# EAGLE schematic DrumVoices (EAGLE 6.5.0)
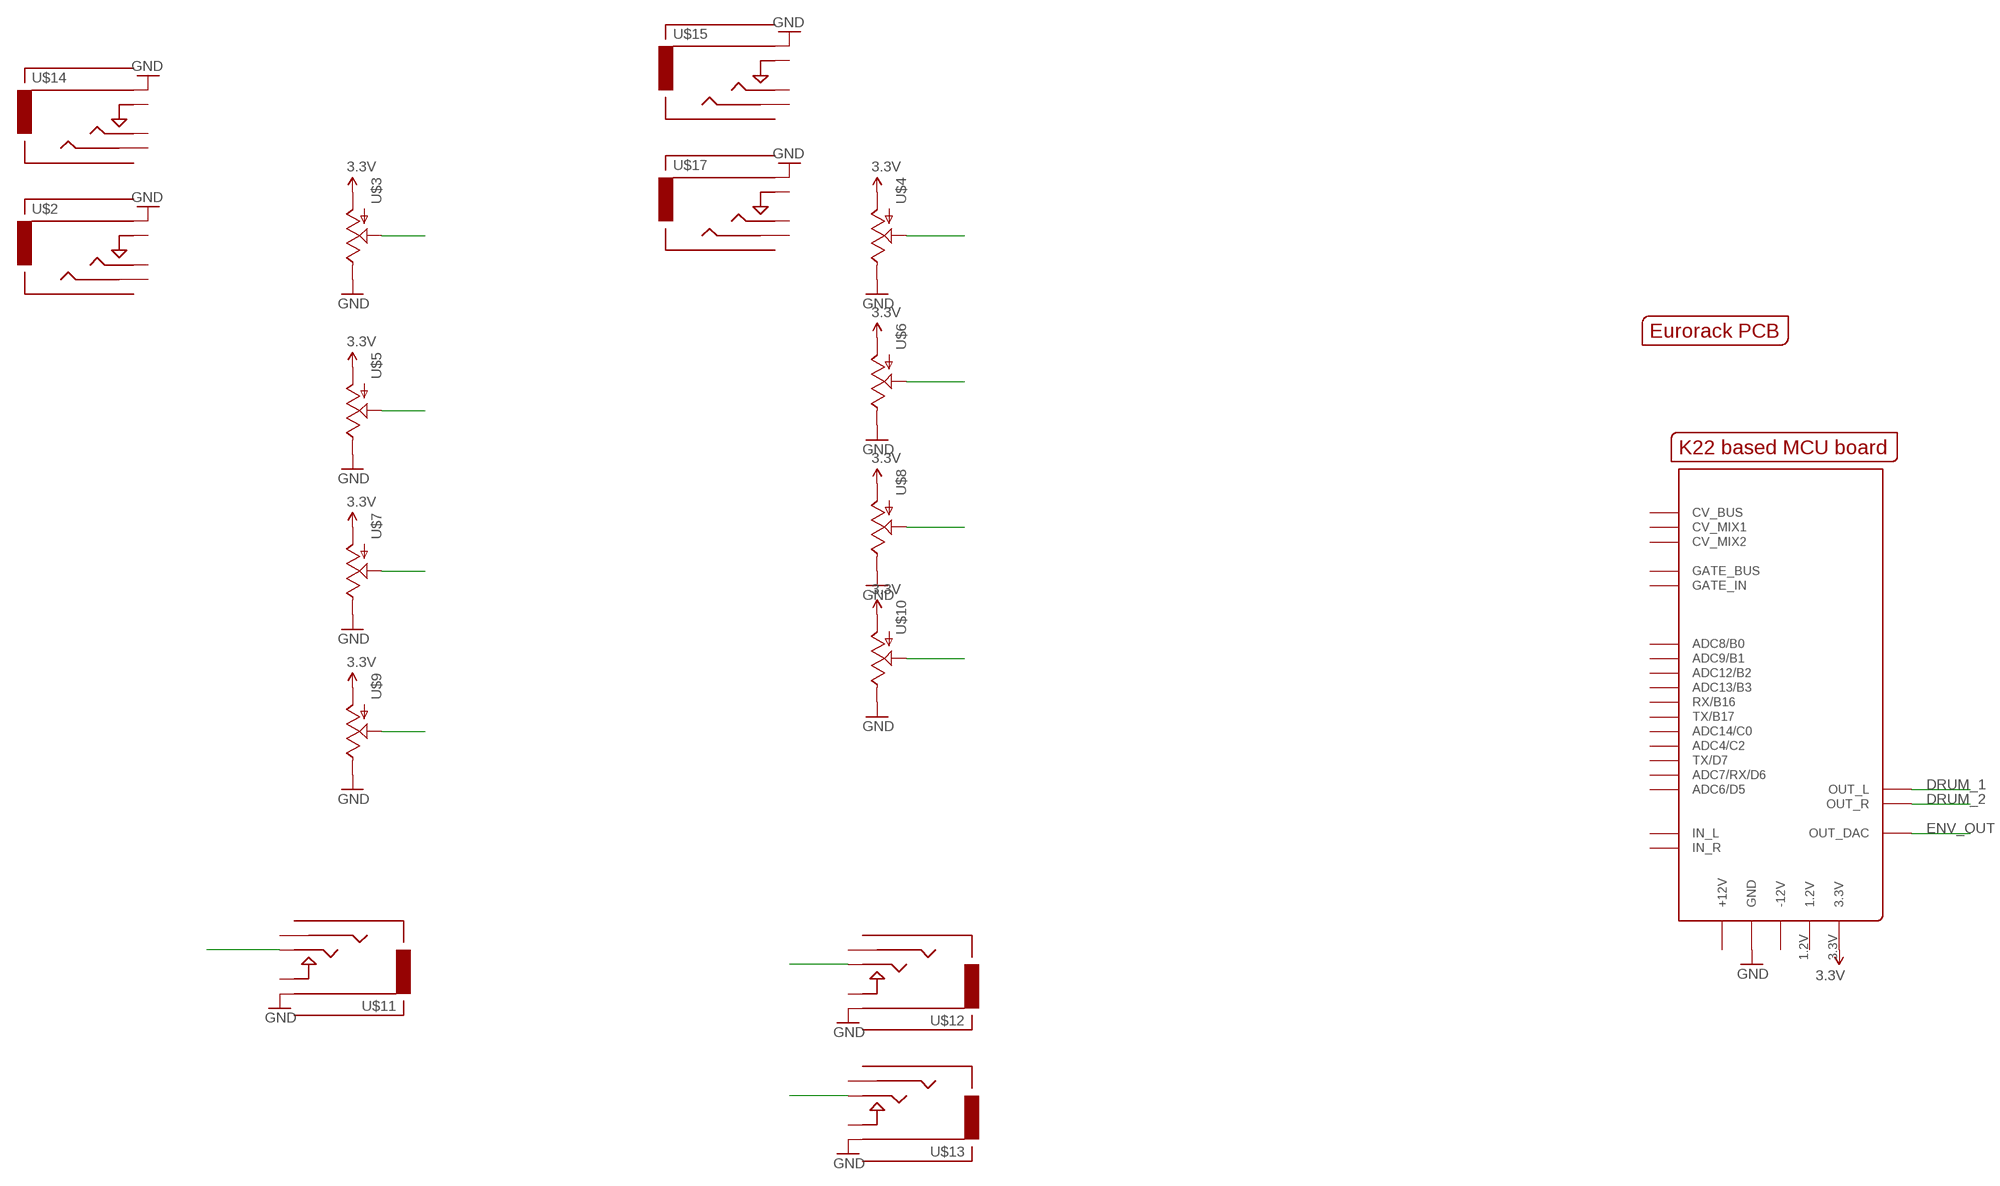
[diagram p0: schematic, sheet 1]

## Parts
U$1  EURORACK_PCB12HP  [EURORACK12HPPCB]
U$2  AUDIO-JACKINPUT  [3.5MM-JACK-SWITCH-13MM-INPUT]
U$3  POTZEPHPOT  [OG-POTS_ALPS_POT_VERTICAL]
U$4  POTZEPHPOT  [OG-POTS_ALPS_POT_VERTICAL]
U$5  POTZEPHPOT  [OG-POTS_ALPS_POT_VERTICAL]
U$6  POTZEPHPOT  [OG-POTS_ALPS_POT_VERTICAL]
U$7  POTZEPHPOT  [OG-POTS_ALPS_POT_VERTICAL]
U$8  POTZEPHPOT  [OG-POTS_ALPS_POT_VERTICAL]
U$9  POTZEPHPOT  [OG-POTS_ALPS_POT_VERTICAL]
U$10  POTZEPHPOT  [OG-POTS_ALPS_POT_VERTICAL]
U$11  AUDIO-JACKOUTPUT  [3.5MM-JACK-SWITCH-13MM-OUTPUT]
U$12  AUDIO-JACKOUTPUT  [3.5MM-JACK-SWITCH-13MM-OUTPUT]
U$13  AUDIO-JACKOUTPUT  [3.5MM-JACK-SWITCH-13MM-OUTPUT]
U$14  AUDIO-JACKINPUT  [3.5MM-JACK-SWITCH-13MM-INPUT]
U$15  AUDIO-JACKINPUT  [3.5MM-JACK-SWITCH-13MM-INPUT]
U$16  MCUBOARD  [MCUBASEBOARD]
U$17  AUDIO-JACKINPUT  [3.5MM-JACK-SWITCH-13MM-INPUT]

## Nets
3.3V: U$3.P$3(A) U$4.P$3(A) U$5.P$3(A) U$6.P$3(A) U$7.P$3(A) U$8.P$3(A) U$9.P$3(A) U$10.P$3(A) U$16.3.3V
DRUM_1: U$11.TIP@1(TIP) U$11.TIP@2(TIP) U$16.OUT_L
DRUM_2: U$12.TIP@1(TIP) U$12.TIP@2(TIP) U$16.OUT_R
ENV_OUT: U$13.TIP@1(TIP) U$13.TIP@2(TIP) U$16.OUT_DAC
GND: U$2.RING@1(RING) U$2.RING@2(RING) U$3.P$1(E) U$4.P$1(E) U$5.P$1(E) U$6.P$1(E) U$7.P$1(E) U$8.P$1(E) U$9.P$1(E) U$10.P$1(E) U$11.RING@1(RING) U$11.RING@2(RING) U$12.RING@1(RING) U$12.RING@2(RING) U$13.RING@1(RING) U$13.RING@2(RING) U$14.RING@1(RING) U$14.RING@2(RING) U$15.RING@1(RING) U$15.RING@2(RING) U$16.GND@1(GND) U$16.GND@2(GND) U$16.GND@4(GND) U$16.GND@5(GND) U$16.GND@6(GND) U$16.GND@7(GND) U$16.GND@8(GND) U$16.GND@9(GND) U$16.GND_BUS(GND) U$17.RING@1(RING) U$17.RING@2(RING)
N$1: U$3.P$2(S)
N$2: U$5.P$2(S)
N$3: U$7.P$2(S)
N$4: U$9.P$2(S)
N$5: U$4.P$2(S)
N$6: U$6.P$2(S)
N$7: U$8.P$2(S)
N$8: U$10.P$2(S)
Unconnected: U$2.SECOND@1(SECOND) U$2.SECOND@2(SECOND) U$2.SWITCH@1(SWITCH) U$2.SWITCH@2(SWITCH) U$2.TIP@1(TIP) U$2.TIP@2(TIP) U$11.SECOND@1(SECOND) U$11.SECOND@2(SECOND) U$11.SWITCH@1(SWITCH) U$11.SWITCH@2(SWITCH) U$12.SECOND@1(SECOND) U$12.SECOND@2(SECOND) U$12.SWITCH@1(SWITCH) U$12.SWITCH@2(SWITCH) U$13.SECOND@1(SECOND) U$13.SECOND@2(SECOND) U$13.SWITCH@1(SWITCH) U$13.SWITCH@2(SWITCH) U$14.SECOND@1(SECOND) U$14.SECOND@2(SECOND) U$14.SWITCH@1(SWITCH) U$14.SWITCH@2(SWITCH) U$14.TIP@1(TIP) U$14.TIP@2(TIP) U$15.SECOND@1(SECOND) U$15.SECOND@2(SECOND) U$15.SWITCH@1(SWITCH) U$15.SWITCH@2(SWITCH) U$15.TIP@1(TIP) U$15.TIP@2(TIP) U$16.1.2V U$16.+12V@1(+12V) U$16.+12V@2(+12V) U$16.-12V@1(-12V) U$16.-12V@2(-12V) U$16.ADC4(ADC4/C2) U$16.ADC6(ADC6/D5) U$16.ADC7(ADC7/RX/D6) U$16.ADC8(ADC8/B0) U$16.ADC9(ADC9/B1) U$16.ADC12(ADC12/B2) U$16.ADC13(ADC13/B3) U$16.ADC14(ADC14/C0) U$16.CV_MIX1 U$16.CV_MIX2 U$16.CVBUS(CV_BUS) U$16.GATE_BUS U$16.GATE_IN U$16.IN_L U$16.IN_R U$16.RX/B16 U$16.TX/B17 U$16.TX/D7 U$17.SECOND@1(SECOND) U$17.SECOND@2(SECOND) U$17.SWITCH@1(SWITCH) U$17.SWITCH@2(SWITCH) U$17.TIP@1(TIP) U$17.TIP@2(TIP)

## Library data of the parts
U$1 = EurorackModularParts:EURORACK_PCB
U$2 U$11-U$15 U$17 = EurorackModularParts:AUDIO-JACK: Switching Mono 3.5mm Audio Jack from Erthenvar.
U$3-U$10 = EurorackModularParts:POT
U$16 = EurorackModularParts:MCUBOARD